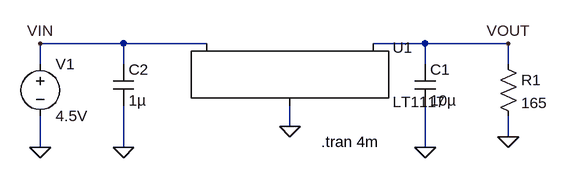
[diagram p0: schematic LDO.asc]
LDO.asc, the LTspice schematic file:
Version 4.1
SHEET 1 880 680
WIRE 0 96 -128 96
WIRE 128 96 0 96
WIRE 464 96 384 96
WIRE 592 96 464 96
WIRE -128 128 -128 96
WIRE 0 128 0 96
WIRE 464 128 464 96
WIRE 592 128 592 96
WIRE 256 224 256 192
WIRE 592 240 592 208
WIRE -128 256 -128 208
WIRE 0 256 0 192
WIRE 464 256 464 192
FLAG -128 256 0
FLAG 0 256 0
FLAG 464 256 0
FLAG 256 224 0
FLAG 592 240 0
FLAG -128 96 VIN
FLAG 592 96 VOUT
SYMBOL PowerProducts\\LT1117 256 96 R0
SYMATTR InstName U1
SYMBOL res 576 112 R0
SYMATTR InstName R1
SYMATTR Value 165
SYMBOL cap 448 128 R0
SYMATTR InstName C1
SYMATTR Value 10µ
SYMBOL cap -16 128 R0
SYMATTR InstName C2
SYMATTR Value 1µ
SYMBOL voltage -128 112 R0
SYMATTR InstName V1
SYMATTR Value 4.5V
TEXT 304 248 Left 2 !.tran 4m

The netlist it stands for:
* LDO.asc
X§U1 0 VOUT VIN LT1117
R1 VOUT 0 165
C1 VOUT 0 10µ
C2 VIN 0 1µ
V1 VIN 0 4.5V
.tran 4m
.lib LT1117.lib
.backanno
.end